# Altium schematic sheet Ram.SchDoc: PSRAM
size 292 x 203 mm; DrawnBy: DMGB Nawarathna; DocumentNumber: -; SheetNumber: 4; SheetTotal: 4; Project: Product Sorter; DateDrawn: 4/4/2024
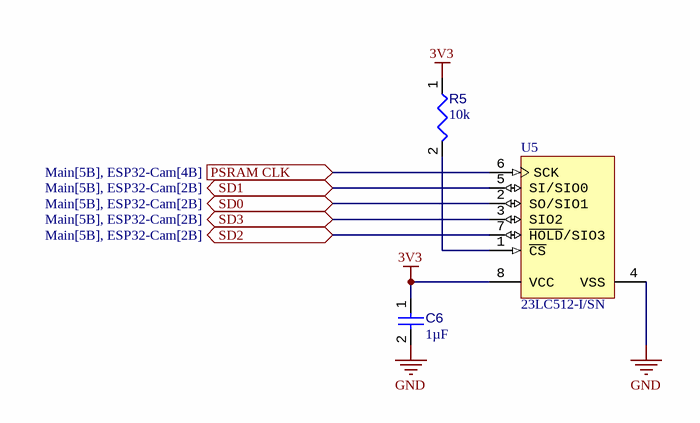
[diagram p0: Ram.SchDoc]

## Parts
C6  value 1µF  [CAPC1608X90X40LL10T20]  (hidden comment: Capacitor 1 uF +/- 10% 25 V 0603)
R5  value 10k  [RESC0402(1005)_L]  (hidden comment: Resistor 10K  +/-1 % 0402 63 mW)
U5  23LC512-I/SN  [MCHP-SOIC-SN8_N]

## Ports
PSRAM CLK (in, see Main[5B], ESP32-Cam[4B]), SD0 (bidir, see Main[5B], ESP32-Cam[2B]), SD1 (bidir, see Main[5B], ESP32-Cam[2B]), SD2 (bidir, see Main[5B], ESP32-Cam[2B]), SD3 (bidir, see Main[5B], ESP32-Cam[2B])

## Nets
3V3: C6.1 R5.1 U5.8(VCC)
GND: C6.2 U5.4(VSS)
PSRAM CLK: U5.6(SCK) ; port PSRAM CLK
SD0: U5.2(SO/SIO1) ; port SD0
SD1: U5.5(SI/SIO0) ; port SD1
SD2: U5.7(~{HOLD}/SIO3) ; port SD2
SD3: U5.3(SIO2) ; port SD3
NetR5_2: R5.2 U5.1(~{CS})

## Notes on the sheet
- Rev.
- Description
- Revisions
- Date
- Aprvd.
- Title
- SCHEMATIC
- Number
- Drawn
- Chkd.
- Name
- Project
- Sheet      of
- Revision

## Library data of the parts
C6 = CMP-001-00005-6: Chip Capacitor, 1 uF, +/- 10%, 25 V, 0603 (1608 Metric); Capacitor Type: Ceramic; Voltage Rating: 25V; Pins: 2; Mounting Technology: SM; RoHS Compliant: True; Max Operating Temperature: 125°C; Case/Package: 0603; Min Operating Temperature: -55°C; Tolerance: 10%
R5 = CMP-009-00149-3: Chip Resistor, 10 kOhms, +/-1 %, 63 mW, -55 to 125 degC, 0402; Power: 63mW; Tolerance: 1%; Min Operating Temperature: -55°C; Case/Package: 0402; Max Operating Temperature: 155°C; Pins: 2
U5 = CMP-0163-00041-1: 512K bits SPI Serial SRAM with SDI and SQI Interface, 2.5 to 5.5 V, 20 MHz, -40 to 85 degC, 8-pin SOIC (SN8), Tube; Manufacturer: Microchip; ComponentLink1Description: Manufacturer URL; DatasheetVersion: Rev. A; ComponentLink3Description: Package Specification; ComponentLink2URL: http://ww1.microchip.com/downloads/en/DeviceDoc/25155A.pdf; ComponentLink4Description: Product URL; ComponentLink4URL: http://www.microchip.com/23LC512; PackageReference: SOIC-SN8; PackageVersion: C04-057C; ComponentLink1URL: http://www.microchip.com; ComponentLink2Description: Datasheet; PackageDescription: 8-Lead Plastic Small Outline, 4.9 x 3.9 mm Body, 1.27 mm Pitch; ComponentLink3URL: http://www.microchip.com/stellent/groups/techpub_sg/documents/packagingspec/en012702.pdf; PartNumber: 23LC512-I/SN; Mounting Technology: Surface Mount